# EAGLE design 2out_servo_2te (EAGLE 6.3)
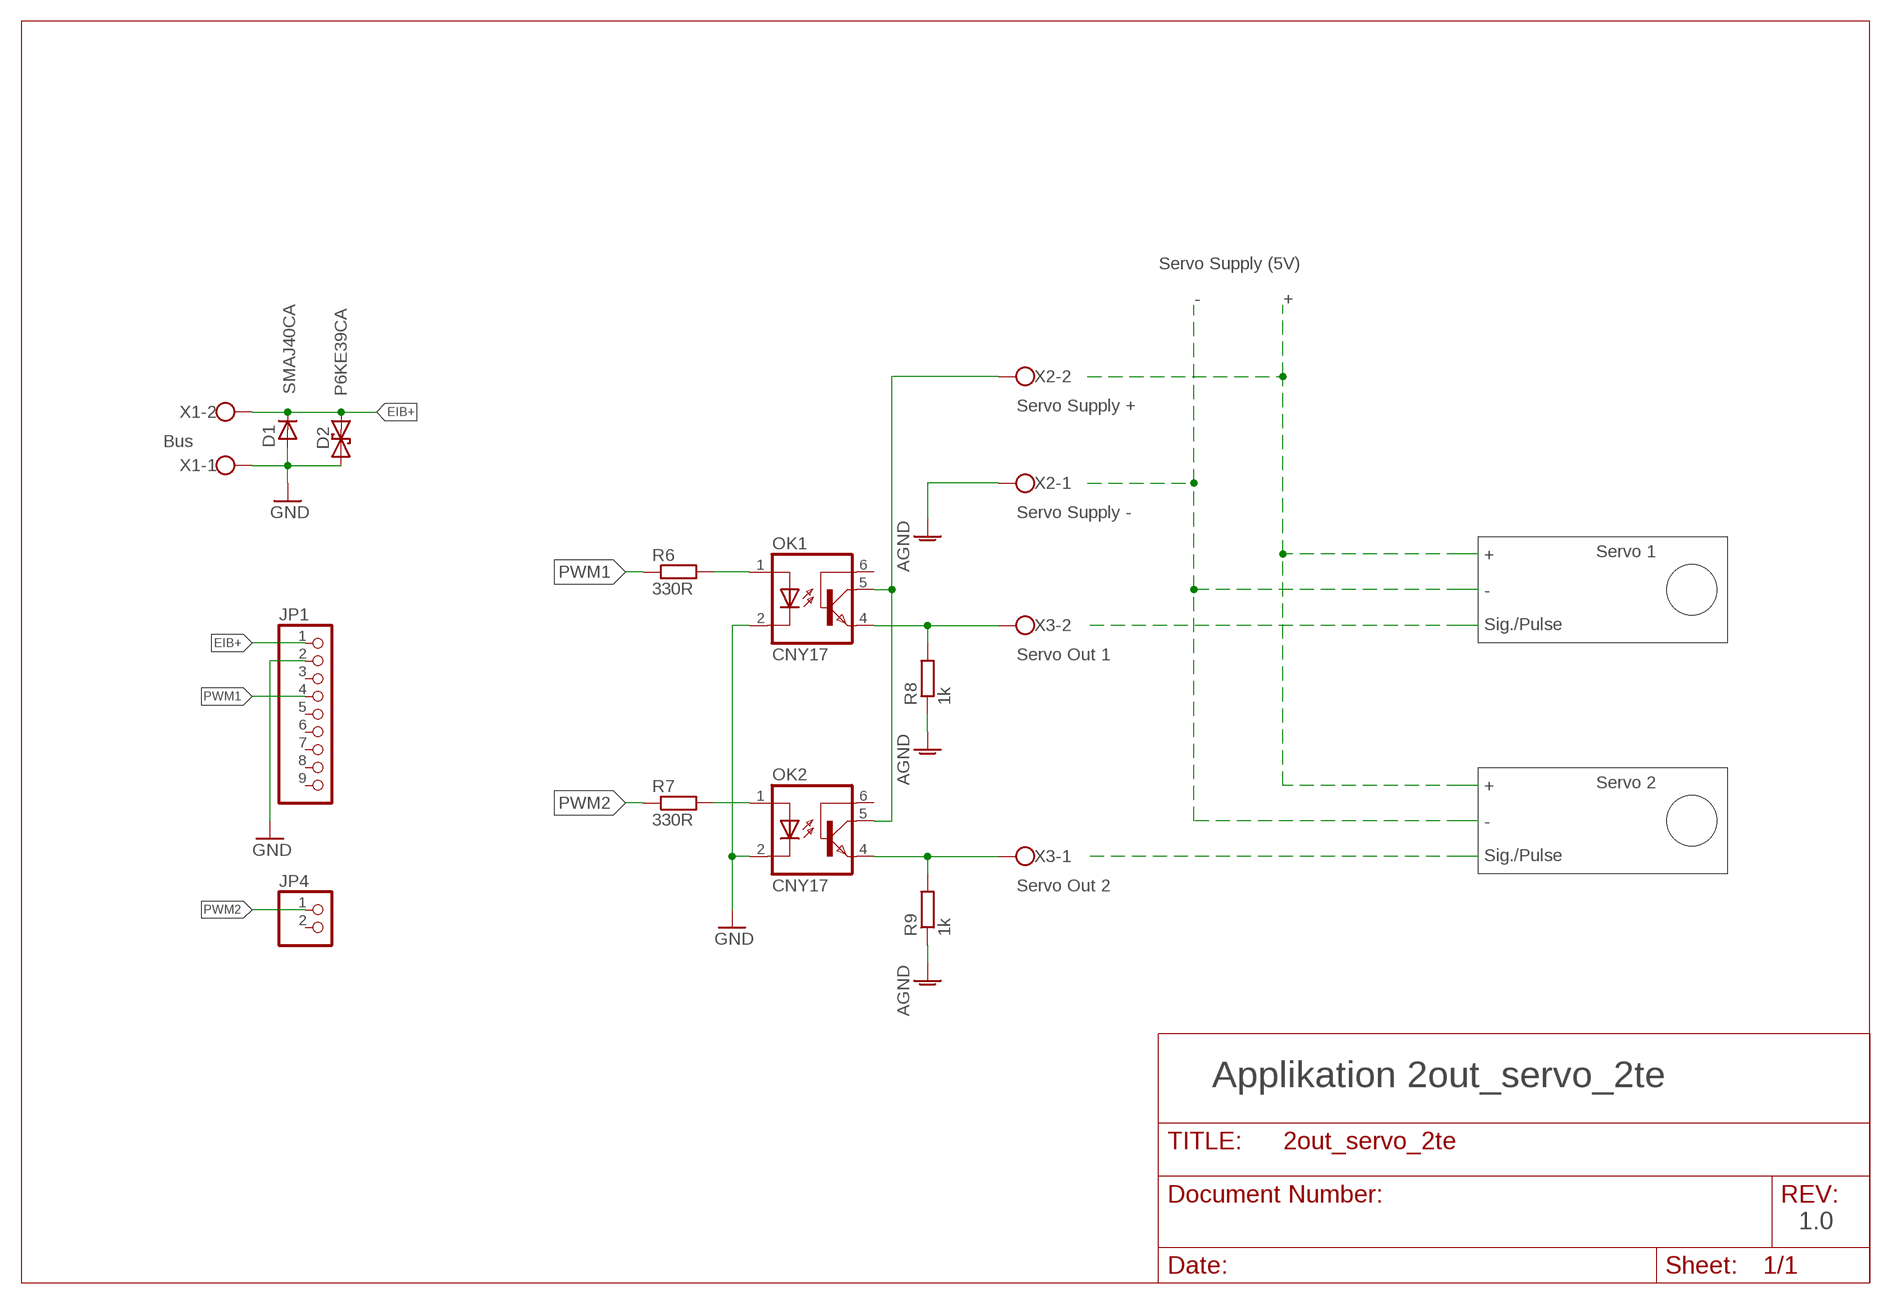
[diagram p0: schematic, sheet 1]

## Parts
D1  SMAJ40CA  D-SOD-87  [SOD87]
D2  P6KE39CA  P6KEXXCDO41-7  [DO41-7]
JP1  PINHD-1X9  [1X09]
JP4  PINHD-1X2  [1X02]
OK1  CNY17  [DIL06]
OK2  CNY17  [DIL06]
R6  330R  R-EU_0207/7  [0207/7]
R7  330R  R-EU_0207/7  [0207/7]
R8  1k  R-EU_0207/7  [0207/7]
R9  1k  R-EU_0207/7  [0207/7]
X1  W237-02P  [W237-132]
X2  W237-02P  [W237-132]
X3  W237-02P  [W237-132]

## Nets
AGND: R8.1 R9.1 X2.1
EIB+: D1.1(C) D2.C JP1.1 X1.2
GND: D1.2(A) D2.A JP1.2 OK1.2(C) OK2.2(C) X1.1
N$2: OK2.1(A) R7.2
N$3: OK1.1(A) R6.2
N$7: OK1.4(EMI) R8.2 X3.2
N$11: OK2.4(EMI) R9.2 X3.1
N$16: OK1.5(COL) OK2.5(COL) X2.2
PWM1: JP1.4 R6.1
PWM2: JP4.1 R7.1
Unconnected: JP1.3 JP1.5 JP1.6 JP1.7 JP1.8 JP1.9 JP4.2 OK1.6(BAS) OK2.6(BAS)

## Notes on the sheet
- Servo Supply (5V)
- - | +
- Servo Supply +
- Bus
- Servo Supply -
- + | Servo 1
- -
- Sig./Pulse
- Servo Out 1
- + | Servo 2
- -
- Sig./Pulse
- Servo Out 2
- Applikation 2out_servo_2te
- 1.0

## Library data of the parts
D1 = semicon-smd-ipc:D-: DIODE unfilled
D2 = diode:P6KEXXC: DIODE transient-voltage suppressor
JP1 = pinhead:PINHD-1X9: PIN HEADER
JP4 = pinhead:PINHD-1X2: PIN HEADER
OK1 OK2 = Uwe:CNY17: SIEMENS OPTO COUPLER; MPN: CNY17-1; OC_FARNELL: 1045399; OC_NEWARK: 05M4044
R6-R9 = rcl:R-EU_: RESISTOR, European symbol
X1-X3 = con-wago-508:W237-02P: WAGO SREW CLAMP

## Board
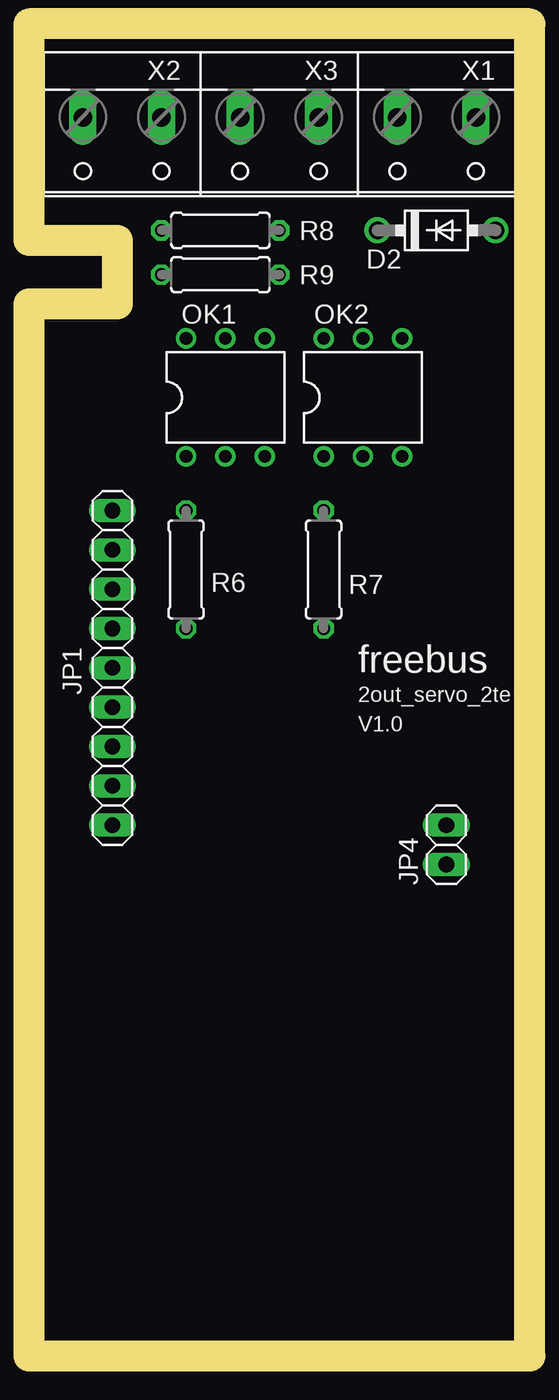
[diagram p1: board, top side]
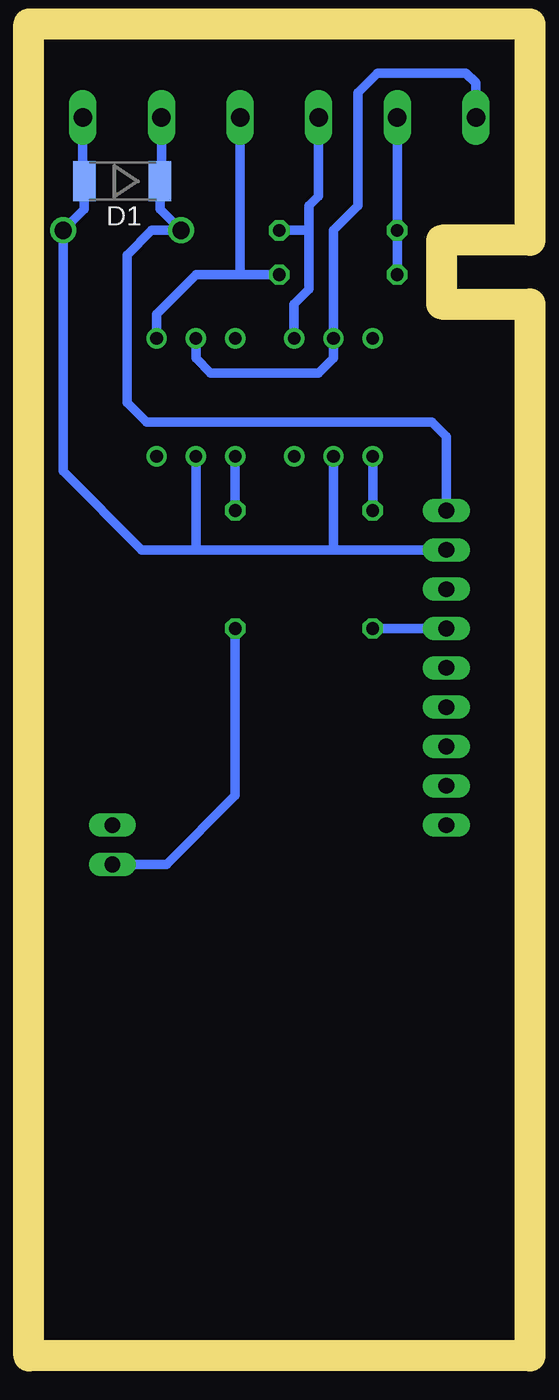
[diagram p2: board, bottom side, seen from below]

Size 31.11 x 85.41 mm. Coordinates in mm from the lower left corner, seen from the top.
Outline: 0,0 0,10.79 0.32,10.79 0.32,67.31 4.13,67.31 6.03,69.22 6.03,71.44 4.13,73.34 0.32,73.34 0.32,85.41 30.8,85.41 30.8,10.79 31.11,10.79 31.11,0 0,0
Copper layers (1*16): Top 0.035mm / dielectric 1.5mm / Bottom 0.035mm
Design rules "platinensammler_02 *": minimum track width 0.1mm, minimum drill 0.7mm, track to track 0.252mm, track to pad 0.252mm, pad to pad 0.252mm, via to via 0.252mm, smd to smd 0.252mm, copper to edge 0.2mm, drill to drill 0.2mm, minimum pad ring 0.25mm, minimum via ring 0.3mm, stop-mask expansion 4mil, vias tented up to drill 0.8mm, thermal gap 0.26mm
Milling: 8 lines

### Footprints (pad centres in the part's own frame; a part is rotated, then mirrored left to right if it is on the bottom)
SOD87 = smd 1.45 x 2.6: 1 -2.445,0; 2 2.445,0
DO41-7 = drill 1.118: A 3.81,0; C -3.81,0
1X09 = drill 1.016 long: 1 -10.16,0; 2 -7.62,0; 3 -5.08,0; 4 -2.54,0; 5 0,0; 6 2.54,0; 7 5.08,0; 8 7.62,0; 9 10.16,0
1X02 = drill 1.016 long: 1 0,0; 2 2.54,0
DIL06 = drill 0.813: 1 -2.54,-3.81; 2 0,-3.81; 3 2.54,-3.81; 4 2.54,3.81; 5 0,3.81; 6 -2.54,3.81
0207/7 = drill 0.813 octagon: 1 -3.81,0; 2 3.81,0
W237-132 = drill 1.194 long: 1 -2.54,-0.635; 2 2.54,-0.635

### Placement (x,y rotation side)
D1  25.72,76.2 180 bottom
D2  25.72,73.03 0 top
JP1  4.76,44.77 270 top
JP4  26.35,32.07 90 top
OK1  12.06,62.23 0 top
OK2  20.95,62.23 0 top
R6  9.53,51.12 90 top
R7  18.41,51.12 90 top
R8  11.75,73.03 0 top
R9  11.75,70.17 0 top
X1  25.72,79.69 180 top
X2  5.4,79.69 180 top
X3  15.56,79.69 180 top

### Tracks (layer width: path | path; a pad name or v marks a point on that pad's centre or on a via)
AGND
  Bottom 0.61: X2.1 R8.1 R9.1
EIB+
  Bottom 0.61: X1.2 23.18,76.3 D1.1 23.27,74.39 D2.C 23.81,73.03 25.4,71.44 25.4,61.91 24.13,60.64 5.71,60.64 4.76,59.69 JP1.1
GND
  Bottom 0.61: JP1.2 12.06,52.39 | 12.06,52.39 20.95,52.39 | 20.95,52.39 24.45,52.39 29.53,57.47 D2.A 28.16,74.39 D1.2 28.26,76.3 X1.1 | OK1.2 12.06,52.39 | OK2.2 20.95,52.39
N$2
  Bottom 0.61: R7.2 OK2.1
N$3
  Bottom 0.61: OK1.1 R6.2
N$7
  Bottom 0.61: X3.2 13.02,75.25 13.65,74.61 13.65,73.03 | 13.65,73.03 13.65,69.22 14.61,68.26 OK1.4 | R8.2 13.65,73.03
N$11
  Bottom 0.61: R9.2 18.1,70.17 | 18.1,70.17 20.95,70.17 23.5,67.63 OK2.4 | X3.1 18.1,70.17
N$16
  Bottom 0.61: X2.2 2.86,82.55 3.49,83.19 9.21,83.19 10.48,81.92 10.48,74.61 12.06,73.03 OK1.5 12.06,64.77 13.02,63.82 20,63.82 20.95,64.77 OK2.5
PWM1
  Bottom 0.61: R6.1 JP1.4
PWM2
  Bottom 0.61: R7.1 18.41,36.51 22.86,32.07 JP4.1

### Text on the board
tPlace: freebus | 2out_servo_2te | V1.0